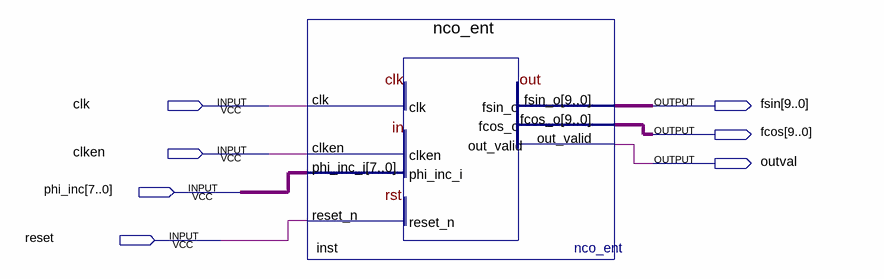
[diagram p0: schematic sheet]
// Quartus schematic Cordic.bdf as structural Verilog: 1 symbols, 7 pins
module Cordic (
  input  clk,
  input  clken,
  input  [7:0] phi_inc,
  input  reset,
  output [9:0] fsin,
  output [9:0] fcos,
  output outval
);

  nco_ent inst (
    .clk(clk), .clken(clken), .phi_inc_i(phi_inc), .reset_n(reset), .fsin_o(fsin), .fcos_o(fcos),
    .out_valid(outval));
endmodule
